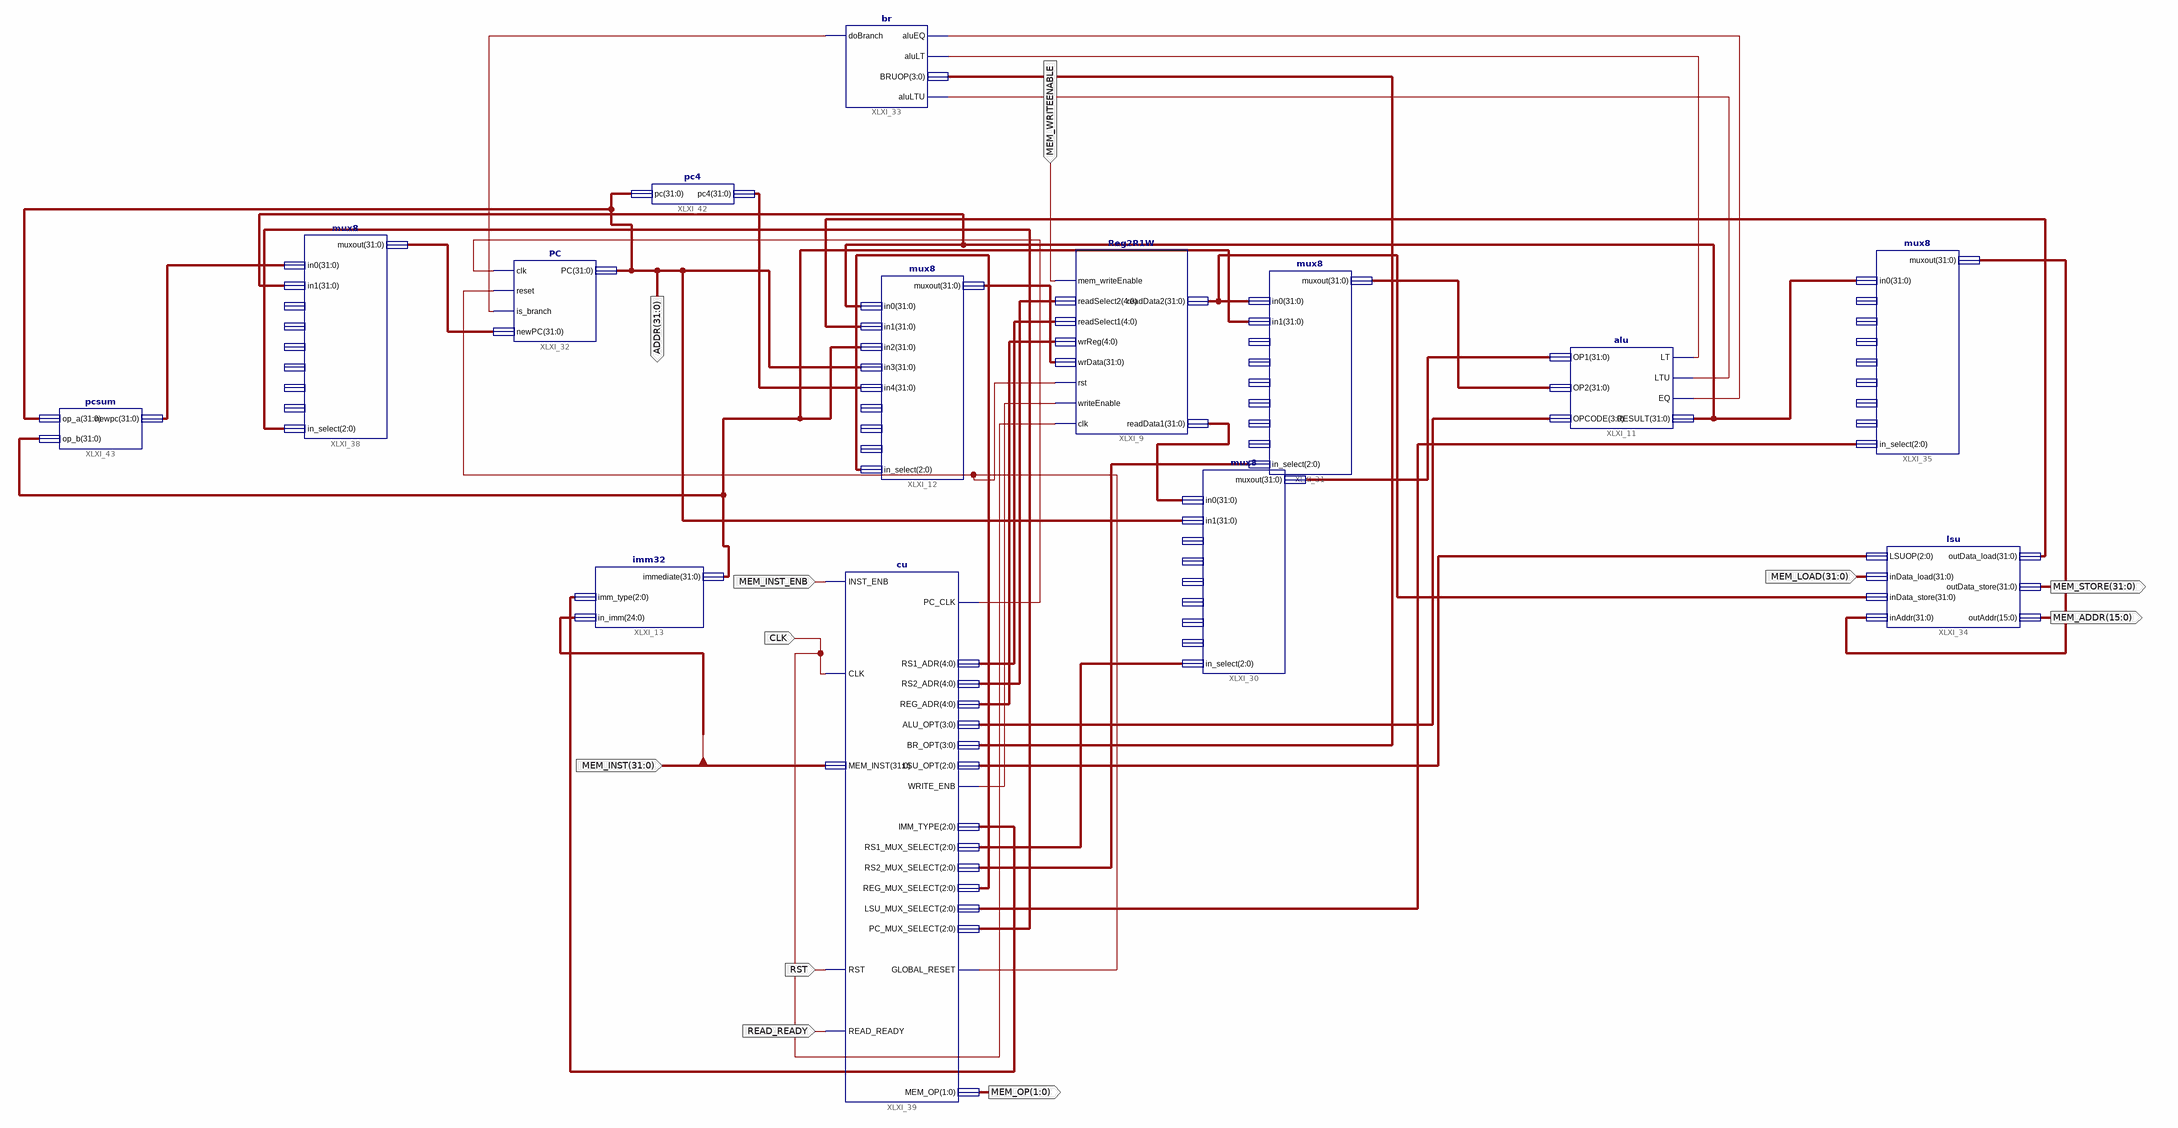
[diagram p0: schematic sheet 1]
// Xilinx ISE schematic schematic.sch (spartan3e) as structural Verilog: 14 symbols, 11 ports
module schematic (
  input  CLK,
  input  MEM_INST_ENB,
  input  [31:0] MEM_LOAD,
  input  RST,
  input  [31:0] MEM_INST,
  input  READ_READY,
  input  MEM_WRITEENABLE,
  output [31:0] ADDR,
  output [15:0] MEM_ADDR,
  output [31:0] MEM_STORE,
  output [1:0] MEM_OP
);

  wire XLXN_7, XLXN_69, XLXN_73, XLXN_75, XLXN_112, XLXN_126, XLXN_128;
  wire [2:0] XLXN_50, XLXN_90, XLXN_119, XLXN_120, XLXN_121, XLXN_124, XLXN_125;
  wire [3:0] XLXN_60, XLXN_74;
  wire [4:0] XLXN_4, XLXN_5, XLXN_6;
  wire [31:0] XLXN_13, XLXN_20, XLXN_53, XLXN_61, XLXN_62, XLXN_67, XLXN_68, XLXN_80, XLXN_91, XLXN_95,
       XLXN_105, XLXN_106;

  Reg2R1W XLXI_9 (
    .clk(CLK), .writeEnable(XLXN_7), .rst(XLXN_112), .wrData(XLXN_20), .wrReg(XLXN_6), .readSelect1(XLXN_4),
    .readSelect2(XLXN_5), .readData1(XLXN_62), .readData2(XLXN_61), .mem_writeEnable(MEM_WRITEENABLE));
  alu XLXI_11 (
    .OP1(XLXN_68), .OP2(XLXN_67), .OPCODE(XLXN_60), .LT(XLXN_126), .LTU(XLXN_128), .EQ(XLXN_75),
    .RESULT(XLXN_13));
  imm32 XLXI_13 (.in_imm(MEM_INST[31:7]), .imm_type(XLXN_50), .immediate(XLXN_53));
  mux8 XLXI_12 (
    .in0(XLXN_13), .in1(XLXN_95), .in2(XLXN_53), .in3(ADDR), .in4(XLXN_80), .muxout(XLXN_20),
    .in_select(XLXN_120));  // open: in5, in6, in7
  mux8 XLXI_31 (
    .in0(XLXN_61), .in1(XLXN_53), .muxout(XLXN_67), .in_select(XLXN_124));  // open: in2, in3, in4, in5, in6, in7
  mux8 XLXI_30 (
    .in0(XLXN_62), .in1(ADDR), .muxout(XLXN_68), .in_select(XLXN_121));  // open: in2, in3, in4, in5, in6, in7
  PC XLXI_32 (.clk(XLXN_69), .reset(XLXN_112), .is_branch(XLXN_73), .newPC(XLXN_106), .PC(ADDR));
  br XLXI_33 (.aluEQ(XLXN_75), .aluLT(XLXN_126), .aluLTU(XLXN_128), .BRUOP(XLXN_74), .doBranch(XLXN_73));
  lsu XLXI_34 (
    .LSUOP(XLXN_90), .inData_load(MEM_LOAD), .inData_store(XLXN_61), .inAddr(XLXN_91),
    .outData_load(XLXN_95), .outData_store(MEM_STORE), .outAddr(MEM_ADDR));
  mux8 XLXI_35 (.in0(XLXN_13), .muxout(XLXN_91), .in_select(XLXN_125));  // open: in1, in2, in3, in4, in5, in6, in7
  mux8 XLXI_38 (
    .in0(XLXN_105), .in1(XLXN_13), .muxout(XLXN_106), .in_select(XLXN_119));  // open: in2, in3, in4, in5, in6, in7
  cu XLXI_39 (
    .INST_ENB(MEM_INST_ENB), .CLK(CLK), .RST(RST), .READ_READY(READ_READY), .MEM_INST(MEM_INST),
    .PC_CLK(XLXN_69), .WRITE_ENB(XLXN_7), .GLOBAL_RESET(XLXN_112), .RS1_ADR(XLXN_4), .RS2_ADR(XLXN_5),
    .REG_ADR(XLXN_6), .ALU_OPT(XLXN_60), .BR_OPT(XLXN_74), .LSU_OPT(XLXN_90), .IMM_TYPE(XLXN_50),
    .RS1_MUX_SELECT(XLXN_121), .RS2_MUX_SELECT(XLXN_124), .REG_MUX_SELECT(XLXN_120),
    .LSU_MUX_SELECT(XLXN_125), .PC_MUX_SELECT(XLXN_119), .MEM_OP(MEM_OP));
  pc4 XLXI_42 (.pc(ADDR), .pc4(XLXN_80));
  pcsum XLXI_43 (.op_a(ADDR), .op_b(XLXN_53), .newpc(XLXN_105));
endmodule
